# Altium schematic sheet Sheet_Top_Front.SchDoc: Sheet_Top_Front
size A4; Organization: Altium Limited; Address1: L3, 12a Rodborough Rd; Address2: Frenchs Forest; Address3: NSW; Address4: Australia 2086
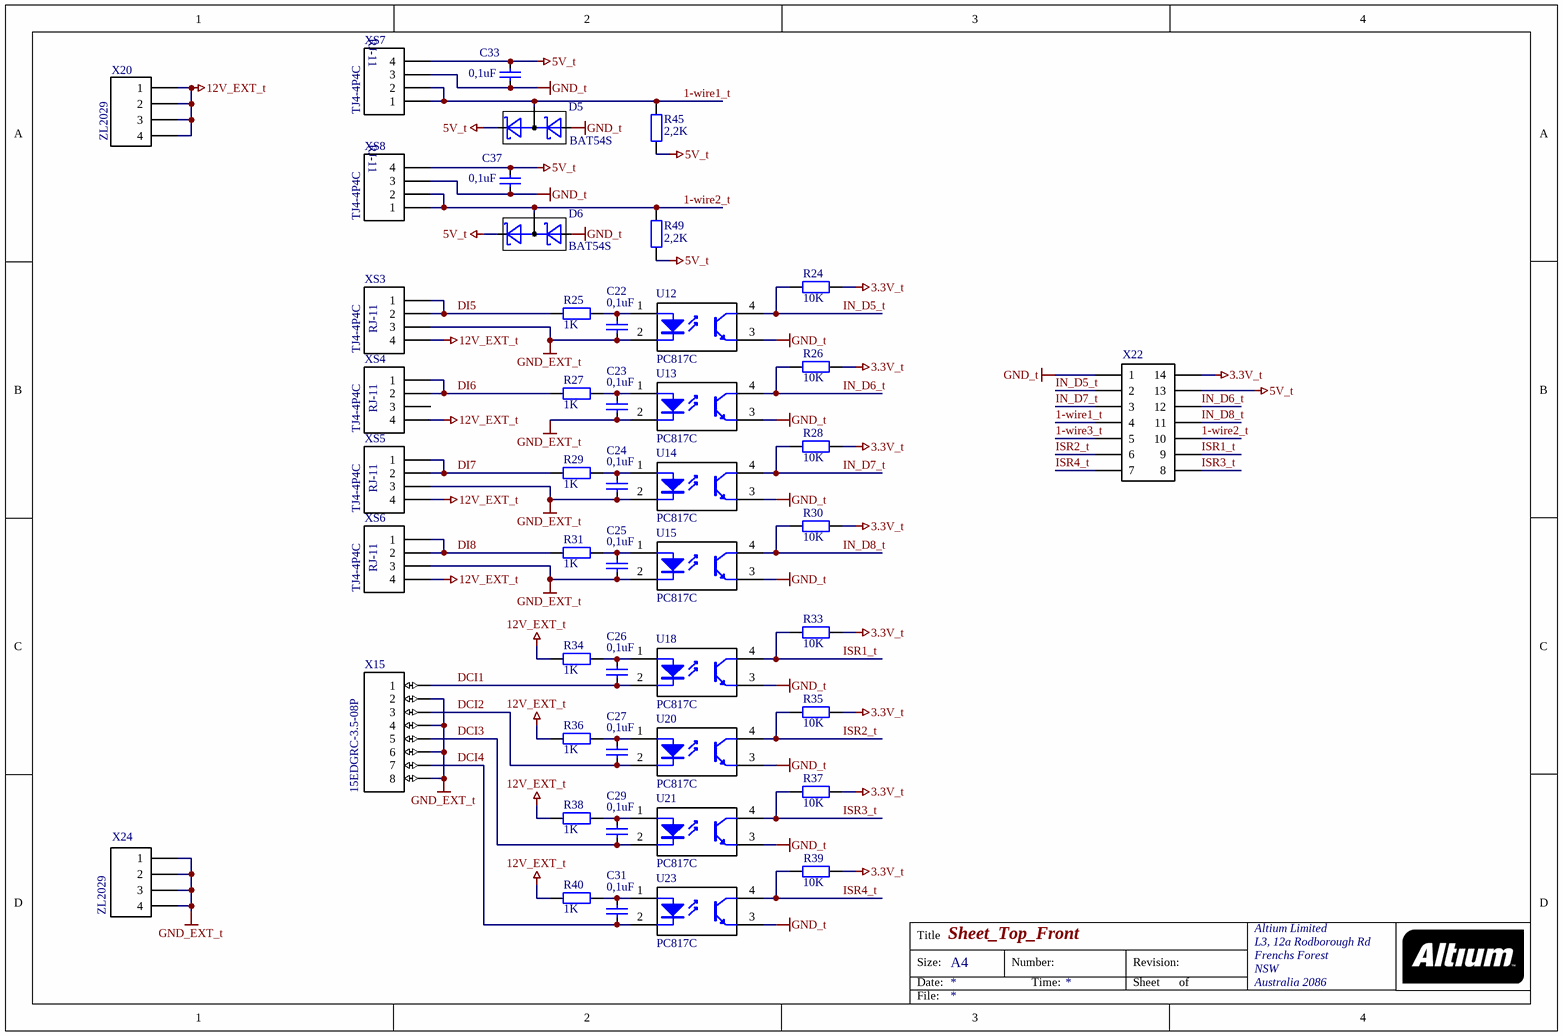
[diagram p0: Sheet_Top_Front.SchDoc]

## Parts
C22  value 0,1uF  [C_0805]  (hidden comment: Cap_Semi)
C23  value 0,1uF  [C_0805]  (hidden comment: Cap_Semi)
C24  value 0,1uF  [C_0805]  (hidden comment: Cap_Semi)
C25  value 0,1uF  [C_0805]  (hidden comment: Cap_Semi)
C26  value 0,1uF  [C_0805]  (hidden comment: Cap_Semi)
C27  value 0,1uF  [C_0805]  (hidden comment: Cap_Semi)
C29  value 0,1uF  [C_0805]  (hidden comment: Cap_Semi)
C31  value 0,1uF  [C_0805]  (hidden comment: Cap_Semi)
C33  value 0,1uF  [C_0805]  (hidden comment: Cap_Semi)
C37  value 0,1uF  [C_0805]  (hidden comment: Cap_Semi)
D5  BAT54S  [SOT-23_d]
D6  BAT54S  [SOT-23_d]
R24  value 10K  [R_0805]  (hidden comment: Resistor)
R25  value 1K  [R_0805]  (hidden comment: Resistor)
R26  value 10K  [R_0805]  (hidden comment: Resistor)
R27  value 1K  [R_0805]  (hidden comment: Resistor)
R28  value 10K  [R_0805]  (hidden comment: Resistor)
R29  value 1K  [R_0805]  (hidden comment: Resistor)
R30  value 10K  [R_0805]  (hidden comment: Resistor)
R31  value 1K  [R_0805]  (hidden comment: Resistor)
R33  value 10K  [R_0805]  (hidden comment: Resistor)
R34  value 1K  [R_0805]  (hidden comment: Resistor)
R35  value 10K  [R_0805]  (hidden comment: Resistor)
R36  value 1K  [R_0805]  (hidden comment: Resistor)
R37  value 10K  [R_0805]  (hidden comment: Resistor)
R38  value 1K  [R_0805]  (hidden comment: Resistor)
R39  value 10K  [R_0805]  (hidden comment: Resistor)
R40  value 1K  [R_0805]  (hidden comment: Resistor)
R45  value 2,2K  [R_0805]  (hidden comment: Resistor)
R49  value 2,2K  [R_0805]  (hidden comment: Resistor)
U12  PC817C  [DIP-4]
U13  PC817C  [DIP-4]
U14  PC817C  [DIP-4]
U15  PC817C  [DIP-4]
U18  PC817C  [DIP-4]
U20  PC817C  [DIP-4]
U21  PC817C  [DIP-4]
U23  PC817C  [DIP-4]
X15  15EDGRC-3.5-08P  [MC_3.5_8]
X20  ZL2029  [PLS-4-3D]
X22  PLS2-14  [PLS2-14]  (value not drawn)
X24  PLS-4  [PLS-4-3D]  (value not drawn)
XS3  RJ-11  [RJ-11 - TJ4-4P4C]  (value not drawn)
XS4  RJ-11  [RJ-11 - TJ4-4P4C]  (value not drawn)
XS5  RJ-11  [RJ-11 - TJ4-4P4C]  (value not drawn)
XS6  RJ-11  [RJ-11 - TJ4-4P4C]  (value not drawn)
XS7  RJ-11  [RJ-11 - TJ4-4P4C]  (value not drawn)
XS8  RJ-11  [RJ-11 - TJ4-4P4C]  (value not drawn)

## Nets
3.3V_t: R24.1 R26.1 R28.1 R30.1 R33.1 R35.1 R37.1 R39.1 X22.14
5V_t: C33.1 C37.1 D5.2(C) D6.2(C) R45.2 R49.2 X22.13 XS7.4 XS8.4
12V_EXT_t: R34.2 R36.2 R38.2 R40.2 X20.1 X20.2 X20.3 X20.4 XS3.4 XS4.4 XS5.4 XS6.4
GND_EXT_t: C22.2 C23.2 C24.2 C25.2 U12.2(K) U13.2(K) U14.2(K) U15.2(K) X15.2 X15.4 X15.6 X15.8 X24.1 X24.2 X24.3 X24.4 XS3.3 XS5.3 XS6.3
GND_t: C33.2 C37.2 D5.1(A) D6.1(A) U12.3(E) U13.3(E) U14.3(E) U15.3(E) U18.3(E) U20.3(E) U21.3(E) U23.3(E) X22.1 XS7.3 XS8.3
1-wire1_t: D5.3(CA) R45.1 X22.4 XS7.1 XS7.2
1-wire2_t: D6.3(CA) R49.1 X22.10 XS8.1 XS8.2
1-wire3_t: X22.5
DCI1: C26.2 U18.2(K) X15.1
DCI2: C27.2 U20.2(K) X15.3
DCI3: C29.2 U21.2(K) X15.5
DCI4: C31.2 U23.2(K) X15.7
DI5: R25.2 XS3.1 XS3.2
DI6: R27.2 XS4.1 XS4.2
DI7: R29.2 XS5.1 XS5.2
DI8: R31.2 XS6.1 XS6.2
IN_D5_t: R24.2 U12.4(C) X22.2
IN_D6_t: R26.2 U13.4(C) X22.12
IN_D7_t: R28.2 U14.4(C) X22.3
IN_D8_t: R30.2 U15.4(C) X22.11
ISR1_t: R33.2 U18.4(C) X22.9
ISR2_t: R35.2 U20.4(C) X22.6
ISR3_t: R37.2 U21.4(C) X22.8
ISR4_t: R39.2 U23.4(C) X22.7
NetC22_1: C22.1 R25.1 U12.1(A)
NetC23_1: C23.1 R27.1 U13.1(A)
NetC24_1: C24.1 R29.1 U14.1(A)
NetC25_1: C25.1 R31.1 U15.1(A)
NetC26_1: C26.1 R34.1 U18.1(A)
NetC27_1: C27.1 R36.1 U20.1(A)
NetC29_1: C29.1 R38.1 U21.1(A)
NetC31_1: C31.1 R40.1 U23.1(A)

Not connected (* = marked no-connect by the designer): XS4 3

## Notes on the sheet
- Title
- Size:
- Date:
- A4
- Number:
- Time:
- Revision:
- Sheet
- of
- File:

## Library data of the parts
C22-C27 C29 C31 C33 C37 = Cap_Semi: Capacitor semi
D5 D6 = BAT54S: Diode Schottky
U12-U15 U18 U20 U21 U23 = PC817: Optocoupler
X15 = MC_3.5_8: Connector 3.5mm
X20 = PLS-4: Header, 4-Pin; LatestRevisionDate: 17-Jul-2002; LatestRevisionNote: Re-released for DXP Platform.; Publisher: Altium Limited
X22 = PLS2-14: Header, 14-Pin
X24 = PLS-4: ZL2029; LatestRevisionDate: 17-Jul-2002; LatestRevisionNote: Re-released for DXP Platform.; Publisher: Altium Limited
XS3-XS8 = RJ-11: TJ4-4P4C